# Altium project 油表.PrjPcb
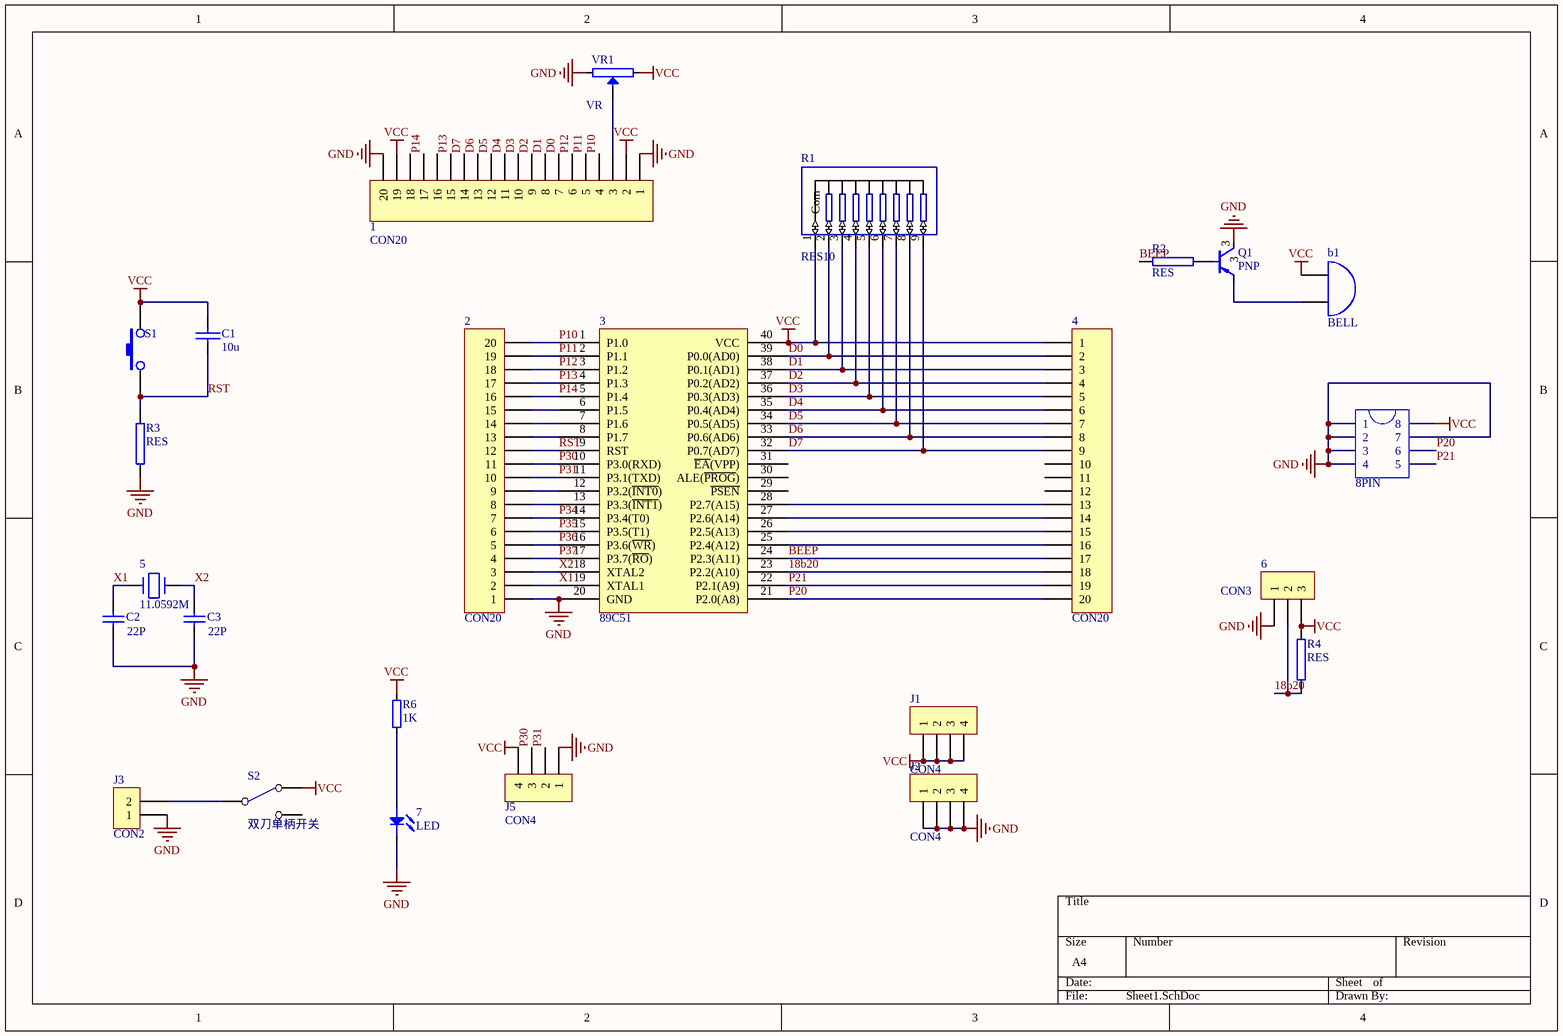
[diagram p0: Sheet1.SchDoc]
1 sheet, 25 parts. Net scope: global (net labels, ports and power ports of the same name join across sheets).
Board file: PCB1.PcbDoc

## Sheet Sheet1.SchDoc
size A4

### Parts
1  CON20  [SIP20]
2  CON20  [SIP20]
3  89C51  [DIP40]
4  CON20  [SIP20]
5  11.0592M  [XTAL]
6  CON3  [SIP3]
7  LED  [LED]
b1  BELL  [bell]
C1  10u  [RAD0.1]
C2  value 22P  [RAD0.1]
C3  value 22P  [RAD0.1]
J1  CON4  [SIP4]
J2  CON4  [SIP4]
J3  CON2  [SIP2]
J5  CON4  [SIP4]
Q1  PNP  [TO-92]
R1  RES10  [SIP9]
R2  RES  [AXIAL0.4]
R3  RES  [AXIAL0.4]
R4  RES  [AXIAL0.4]
R6  1K  [AXIAL0.4]
S1  (no value)  [AN66]
S2  双刀单柄开关  [AN88]
VR1  VR  [VR3296]
  8PIN  [DIP-8]

### Nets
GND: 1.1 1.20 2.1 3.20(GND) 6.1 7.K C2.1 C3.1 J2.1 J2.2 J2.3 J2.4 J3.1 J5.1 Q1.3 R3.1 VR1.2 .1 .2 .3 .4 .7
VCC: 1.2 1.19 3.40(VCC) 4.1 6.3 b1.1 C1.1 J1.1 J1.2 J1.3 J1.4 J5.4 R1.1(Com) R4.1 R6.1 S1.2 S2.2(NC) VR1.1 .8
18b20: 3.23(P2.2(A10)) 4.18 6.2 R4.2
BEEP: 3.24(P2.3(A11)) 4.17 R2.1
D0: 1.7 3.39(P0.0(AD0)) 4.2 R1.2
D1: 1.8 3.38(P0.1(AD1)) 4.3 R1.3
D2: 1.9 3.37(P0.2(AD2)) 4.4 R1.4
D3: 1.10 3.36(P0.3(AD3)) 4.5 R1.5
D4: 1.11 3.35(P0.4(AD4)) 4.6 R1.6
D5: 1.12 3.34(P0.5(AD5)) 4.7 R1.7
D6: 1.13 3.33(P0.6(AD6)) 4.8 R1.8
D7: 1.14 3.32(P0.7(AD7)) 4.9 R1.9
P10: 1.4 2.20 3.1(P1.0)
P11: 1.5 2.19 3.2(P1.1)
P12: 1.6 2.18 3.3(P1.2)
P13: 1.15 2.17 3.4(P1.3)
P14: 1.17 2.16 3.5(P1.4)
P20: 3.21(P2.0(A8)) 4.20 .6
P21: 3.22(P2.1(A9)) 4.19 .5
P30: 2.11 3.10(P3.0(RXD)) J5.3
P31: 2.10 3.11(P3.1(TXD)) J5.2
P34: 2.7 3.14(P3.4(T0))
P35: 2.6 3.15(P3.5(T1))
P36: 2.5 3.16(P3.6(~{WR}))
P37: 2.4 3.17(P3.7(~{RO}))
RST: 2.12 3.9(RST) C1.2 R3.2 S1.1
X1: 2.2 3.19(XTAL1) 5.2 C2.2
X2: 2.3 3.18(XTAL2) 5.1 C3.2
Net1_3: 1.3 VR1.W
Net2_8: 2.8 3.13(P3.3(~{INT1}))
Net2_9: 2.9 3.12(P3.2(~{INT0}))
Net2_13: 2.13 3.8(P1.7)
Net2_14: 2.14 3.7(P1.6)
Net2_15: 2.15 3.6(P1.5)
Net3_25: 3.25(P2.4(A12)) 4.16
Net3_26: 3.26(P2.5(A13)) 4.15
Net3_27: 3.27(P2.6(A14)) 4.14
Net3_28: 3.28(P2.7(A15)) 4.13
Net7_A: 7.A R6.2
Netb1_2: b1.2 Q1.2
NetJ3_2: J3.2 S2.1(COMMON)
NetQ1_1: Q1.1 R2.2

Not connected (* = marked no-connect by the designer): 1 16 18; 3 29(~{PSEN}) 30(ALE(~{PROG})) 31(~{EA}(VPP)); 4 10 11 12; S2 3(NO)

### Library data of the parts
5 = CRYSTAL
7 = LED: pin to pad: A>1 K>2
C1 = CAP
C2 C3 = Cap: Capacitor; Published: 8-Jun-2000; LatestRevisionDate: 17-Jul-2002; LatestRevisionNote: Re-released for DXP Platform.; PackageReference: RAD-0.3; Publisher: Altium Limited
J1 J2 = CON4: Connector
R6 = RES
S1 = 微动开关